# EAGLE design stm8s003_esc (EAGLE 9.0.1)
Assembly variants: A3940, A3941

## Sheet 1 of 3
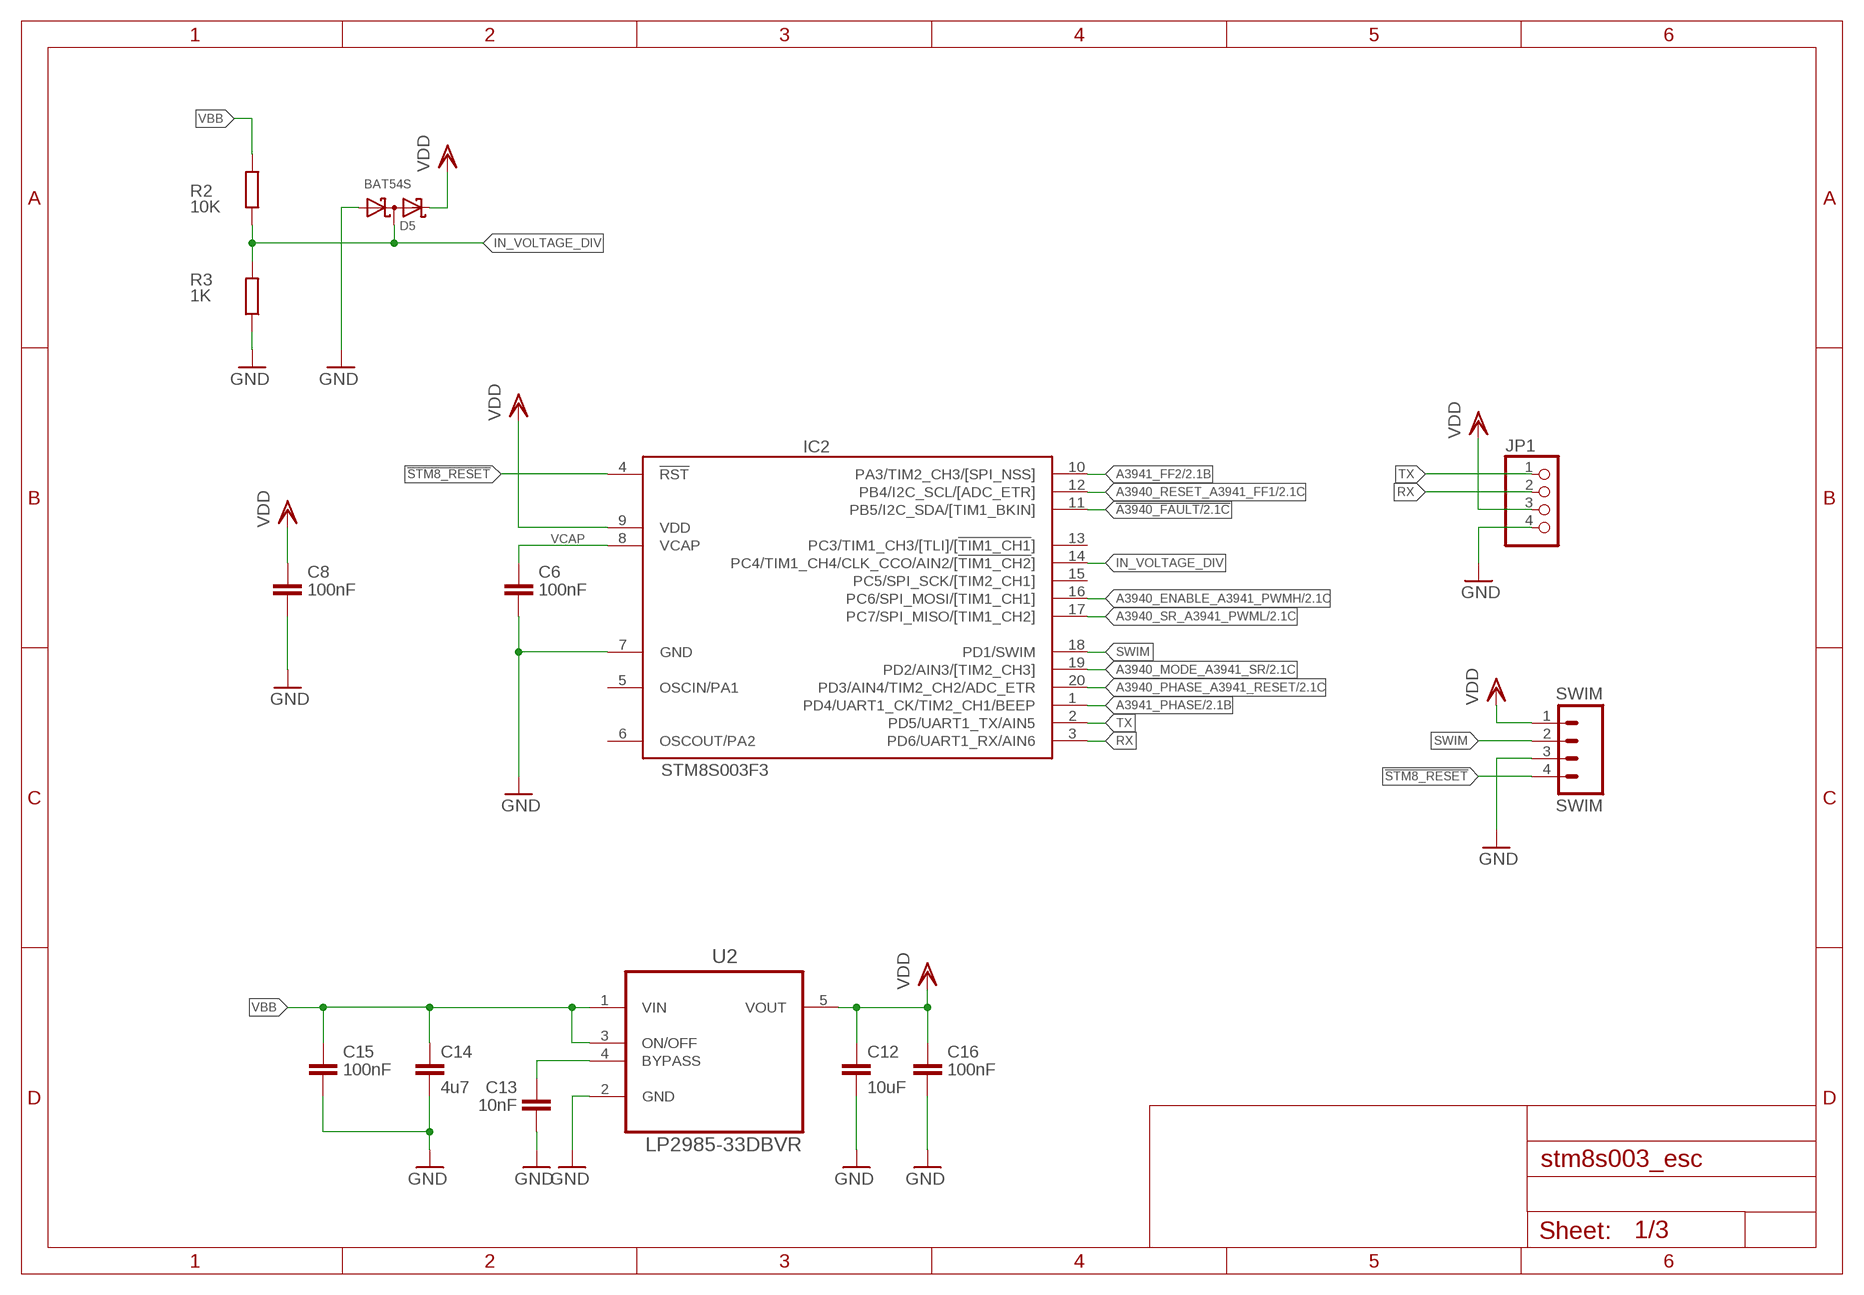
[diagram p0: schematic, sheet 1]

### Parts
C6  100nF  C-EUC0603  [C0603]
C8  100nF  C-EUC0603  [C0603]
C12  10uF  C-EUC0805  [C0805]
C13  10nF  C-EUC0603  [C0603]
C14  4u7  C-EUC0805  [C0805]
C15  100nF  C-EUC0603  [C0603]
C16  100nF  C-EUC0603K  [C0603K]
D5  BAT54S  [SOT23]
IC2  STM8S003F3  [TSSOP20]
JP1  PINHD-1X4  [1X04]
R2  10K  R-EU_R0603  [R0603]
R3  1K  R-EU_R0603  [R0603]
SWIM  SWIM  M041.27MM  [1X04-1.27MM]
U2  LP2985-33DBVR  LP2985AIM5-3.3  [SOT95P284X119-5N]

### Nets
!A3940_FAULT: IC2.11(PB5/I2C_SDA/[TIM1_BKIN]) ; also sheet 2
!STM8_RESET: IC2.4(!RST) SWIM.4
A3940_ENABLE_A3941_PWMH: IC2.16(PC6/SPI_MOSI/[TIM1_CH1]) ; also sheet 2
A3940_MODE_A3941_SR: IC2.19(PD2/AIN3/[TIM2_CH3]) ; also sheet 2
A3940_PHASE_A3941_RESET: IC2.20(PD3/AIN4/TIM2_CH2/ADC_ETR) ; also sheet 2
A3940_RESET_A3941_FF1: IC2.12(PB4/I2C_SCL/[ADC_ETR]) ; also sheet 2
A3940_SR_A3941_PWML: IC2.17(PC7/SPI_MISO/[TIM1_CH2]) ; also sheet 2
A3941_FF2: IC2.10(PA3/TIM2_CH3/[SPI_NSS]) ; also sheet 2
A3941_PHASE: IC2.1(PD4/UART1_CK/TIM2_CH1/BEEP) ; also sheet 2
GND: C6.2 C8.2 C12.2 C13.2 C14.2 C15.2 C16.2 D5.1(A1) IC2.7(GND) JP1.4 R3.1 SWIM.3 U2.2(GND) ; also sheet 2,3
IN_VOLTAGE_DIV: D5.3(C1A2) IC2.14(PC4/TIM1_CH4/CLK_CCO/AIN2/[!TIM1_CH2!]) R2.1 R3.2
LP2985_BYPASS: C13.1 U2.4(BYPASS)
RX: IC2.3(PD6/UART1_RX/AIN6) JP1.2
SWIM: IC2.18(PD1/SWIM) SWIM.2
TX: IC2.2(PD5/UART1_TX/AIN5) JP1.1
VBB: C14.1 C15.1 R2.2 U2.1(VIN) U2.3(ON/OFF) ; also sheet 2
VCAP: C6.1 IC2.8(VCAP)
VDD: C8.1 C12.1 C16.1 D5.2(C2) IC2.9(VDD) JP1.3 SWIM.1 U2.5(VOUT)
Unconnected: IC2.5(OSCIN/PA1) IC2.6(OSCOUT/PA2) IC2.13(PC3/TIM1_CH3/[TLI]/[!TIM1_CH1!]) IC2.15(PC5/SPI_SCK/[TIM2_CH1])

## Sheet 2 of 3
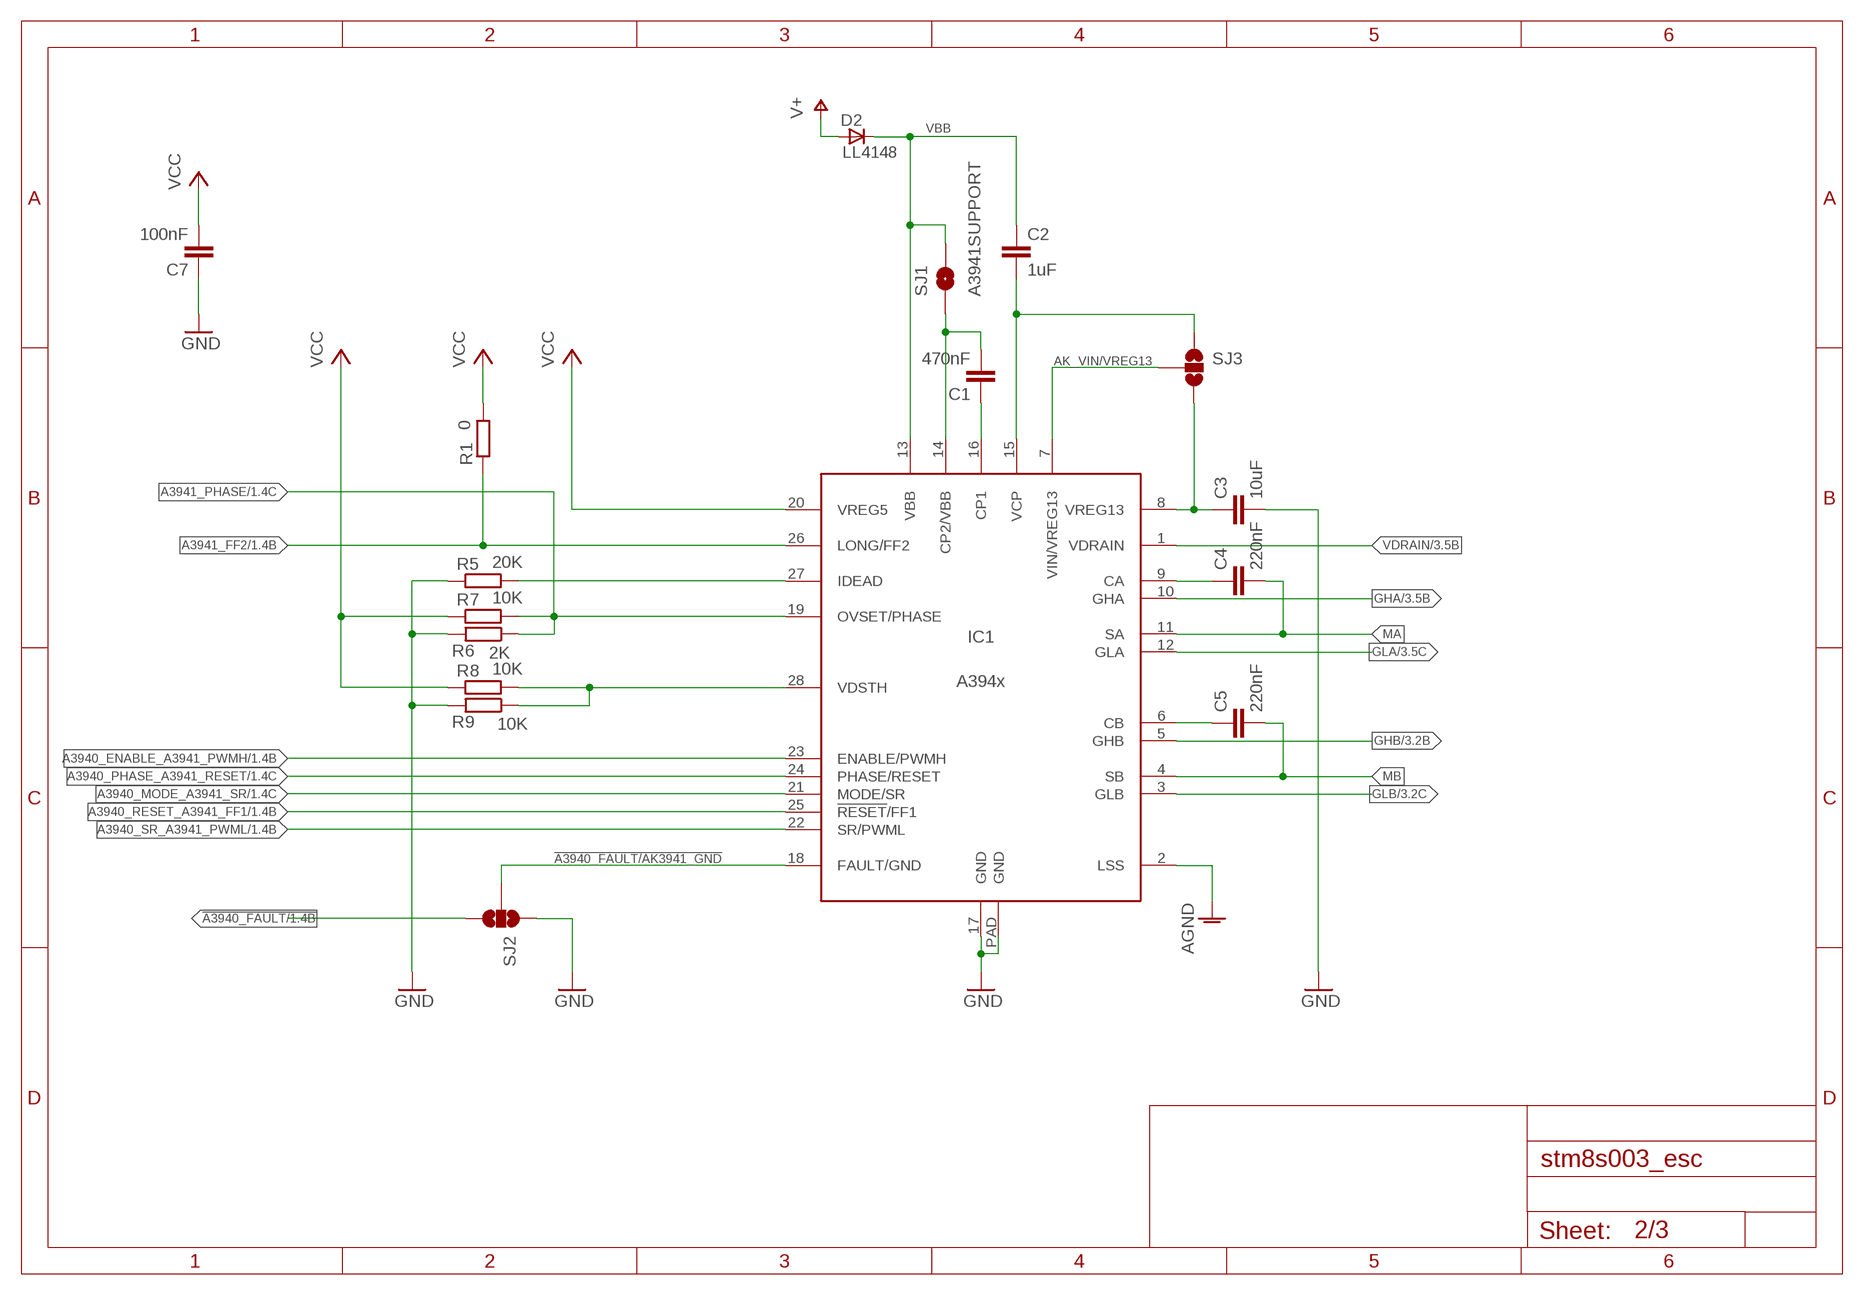
[diagram p1: schematic, sheet 2]

### Parts
C1  470nF  C-EUC0603  [C0603]
C2  1uF  C-EUC0603  [C0603]
C3  10uF  C-EUC0603  [C0603]
C4  220nF  C-EUC0603  [C0603]
C5  220nF  C-EUC0603  [C0603]
C7  100nF  C-EUC0603  [C0603]
D2  LL4148  [SOD80_DO213AA_MINIMELF]
IC1  A394x  A3940/41  [TSSOP28-PAD]
R1  0  R-EU_R0603  [R0603]
R5  20K  R-EU_R0603  [R0603]
R6  2K  R-EU_R0603  [R0603]
R7  10K  R-EU_R0603  [R0603]
R8  10K  R-EU_R0603  [R0603]
R9  10K  R-EU_R0603  [R0603]
SJ1  A3941SUPPORT  SOLDERJUMPERNO  [SJ_2S-NO]
SJ2  SOLDERJUMPER_2WAYPASTE2&3  [SJ_3_PASTE2&3]
SJ3  SOLDERJUMPER_2WAYPASTE2&3  [SJ_3_PASTE2&3]

### Nets
!A3940_FAULT: SJ2.3 ; also sheet 1
!A3940_FAULT/AK3941_GND: IC1.18(FAULT/GND) SJ2.2
A3940_ENABLE_A3941_PWMH: IC1.23(ENABLE/PWMH) ; also sheet 1
A3940_MODE_A3941_SR: IC1.21(MODE/SR) ; also sheet 1
A3940_PHASE_A3941_RESET: IC1.24(PHASE/RESET) ; also sheet 1
A3940_RESET_A3941_FF1: IC1.25(!RESET!/FF1) ; also sheet 1
A3940_SR_A3941_PWML: IC1.22(SR/PWML) ; also sheet 1
A3941_FF2: IC1.26(LONG/FF2) R1.1 ; also sheet 1
A3941_PHASE: IC1.19(OVSET/PHASE) R6.1 R7.2 ; also sheet 1
AGND: IC1.2(LSS) ; also sheet 3
AK_CA: C4.1 IC1.9(CA)
AK_CB: C5.1 IC1.6(CB)
AK_VDSTH: IC1.28(VDSTH) R8.2 R9.1
AK_VIN/VREG13: IC1.7(VIN/VREG13) SJ3.2
AK_VREG13: C3.1 IC1.8(VREG13) SJ3.3
CP1: C1.1 IC1.16(CP1)
CP2: C1.2 IC1.14(CP2/VBB) SJ1.1
GHA: IC1.10(GHA) ; also sheet 3
GHB: IC1.5(GHB) ; also sheet 3
GLA: IC1.12(GLA) ; also sheet 3
GLB: IC1.3(GLB) ; also sheet 3
GND: C3.2 C7.1 IC1.17(GND) IC1.PAD(GND) R5.1 R6.2 R9.2 SJ2.1 ; also sheet 1,3
IDEAD: IC1.27(IDEAD) R5.2
MA: C4.2 IC1.11(SA)
MB [AKPINS]: C5.2 IC1.4(SB)
V+: D2.A ; also sheet 3
VBB: C2.1 D2.C IC1.13(VBB) SJ1.2 ; also sheet 1
VCC: C7.2 IC1.20(VREG5) R1.2 R7.1 R8.1
VCP: C2.2 IC1.15(VCP) SJ3.1
VDRAIN: IC1.1(VDRAIN) ; also sheet 3

## Sheet 3 of 3
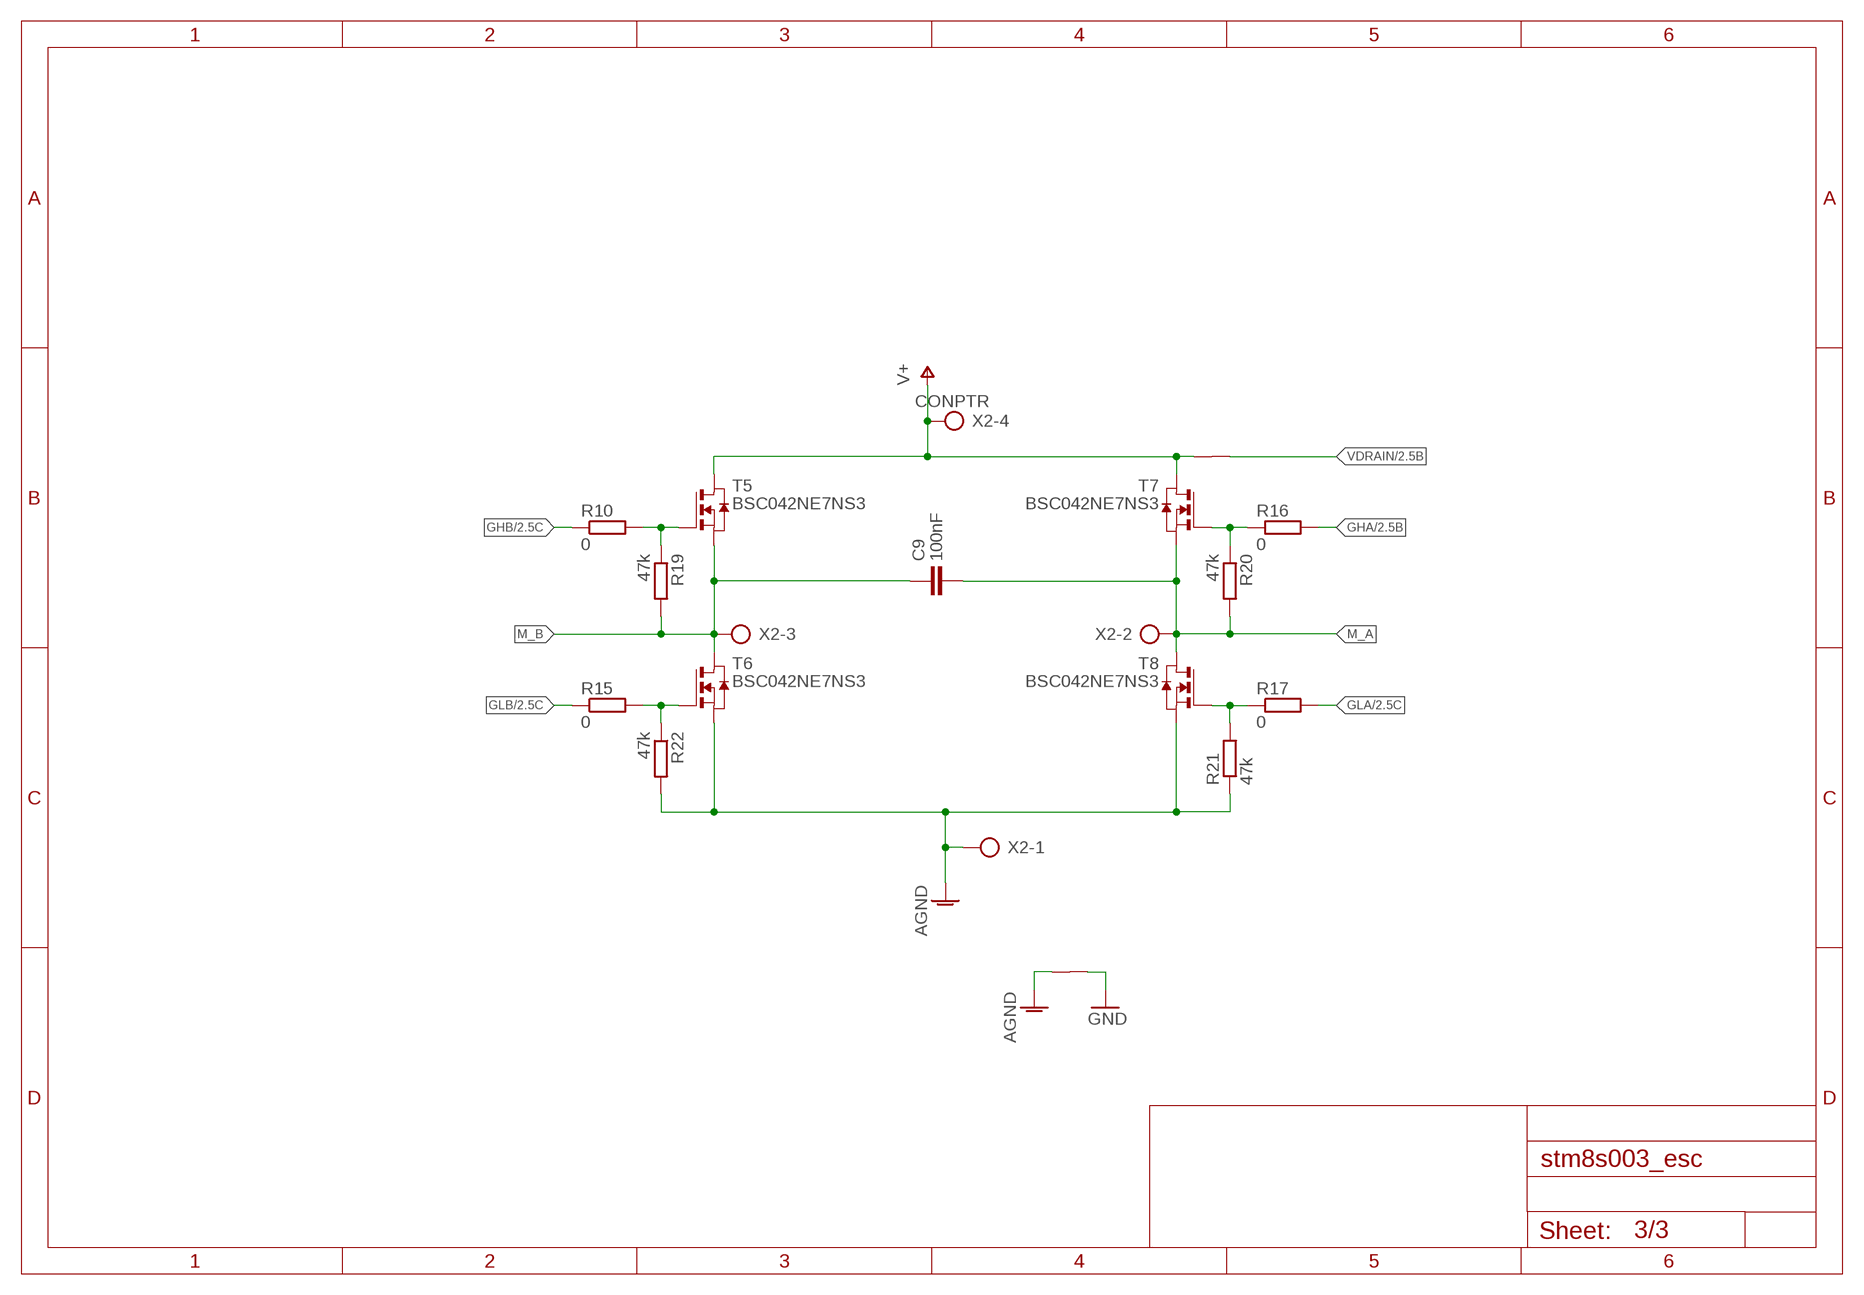
[diagram p2: schematic, sheet 3]

### Parts
C9  100nF  C-EUC0603  [C0603]
GND_JUNCTION  AGND_DGND_JUNCTION  [AGND_DGND_JUNCTION]
R10  0  R-EU_R0603  [R0603]
R15  0  R-EU_R0603  [R0603]
R16  0  R-EU_R0603  [R0603]
R17  0  R-EU_R0603  [R0603]
R19  47k  R-EU_R0603  [R0603]
R20  47k  R-EU_R0603  [R0603]
R21  47k  R-EU_R0603  [R0603]
R22  47k  R-EU_R0603  [R0603]
T5  BSC042NE7NS3  BSC067N06LS3_G_PG-TDSON-8  [PG-TDSON-8]
T6  BSC042NE7NS3  BSC067N06LS3_G_PG-TDSON-8  [PG-TDSON-8]
T7  BSC042NE7NS3  BSC067N06LS3_G_PG-TDSON-8  [PG-TDSON-8]
T8  BSC042NE7NS3  BSC067N06LS3_G_PG-TDSON-8  [PG-TDSON-8]
V+_JUNCTION  AGND_DGND_JUNCTION  [AGND_DGND_JUNCTION]
X2  CONPTR  AK300/4  [AK300/4]

### Nets
AGND: GND_JUNCTION.AGND R21.1 R22.2 T6.1(S) T6.2(S) T6.3(S) T8.1(S) T8.2(S) T8.3(S) X2.1 ; also sheet 2
GHA: R16.2 ; also sheet 2
GHA_R: R16.1 R20.1 T7.4(G)
GHB: R10.1 ; also sheet 2
GHB_R: R10.2 R19.1 T5.4(G)
GLA: R17.2 ; also sheet 2
GLA_R: R17.1 R21.2 T8.4(G)
GLB: R15.1 ; also sheet 2
GLB_R: R15.2 R22.1 T6.4(G)
GND: GND_JUNCTION.DGND ; also sheet 1,2
M_A [AKPINS]: C9.2 R20.2 T7.1(S) T7.2(S) T7.3(S) T8.5(D) T8.6(D) T8.7(D) T8.8(D) T8.D X2.2
M_B [AKPINS]: C9.1 R19.2 T5.1(S) T5.2(S) T5.3(S) T6.5(D) T6.6(D) T6.7(D) T6.8(D) T6.D X2.3
V+: T5.5(D) T5.6(D) T5.7(D) T5.8(D) T5.D T7.5(D) T7.6(D) T7.7(D) T7.8(D) T7.D V+_JUNCTION.AGND X2.4 ; also sheet 2
VDRAIN: V+_JUNCTION.DGND ; also sheet 2

## Library data of the parts
C1-C5 C7 = resistor:C-EU: CAPACITOR, European symbol
C6 C8 C9 C15 C16 = rcl:C-EU: CAPACITOR, European symbol; OC_LOMEX: 82-06-23
C12 C14 = rcl:C-EU: CAPACITOR, European symbol
C13 = rcl:C-EU: CAPACITOR, European symbol; OC_LOMEX: 82-08-73
D2 = _hhn_diodes_smd:LL4148: 1N4148 General Purpose Rectifie SMD-Version of 1N4148 Case: SOD 80 = DO 213 AA = MINIMELF (Glass) Author: Dipl.-Ing. FH Rainer Bayer HHN Hochschule Heilbronn, rainer.bayer@hs-heilbronn.de Ingenieurbüro ing-rb, mail@ing-rb.de
D5 = diode:BAT54S: Schottky Diodes Pin connection corrected 2011-05-04 Source: Fairchild .. BAT54.pdf; OC_RET: 95-03-19
GND_JUNCTION V+_JUNCTION = martonmiklos:AGND_DGND_JUNCTION
IC1 = allegro:A3940/41: Combined symbol for A3940 and A3941. The pins with different pin functions has the following naming convention: <A3940 name>/<A3941 name>
IC2 = stm8:STM8S003: Value line, 16 MHz STM8S 8-bit MCU, 8 Kbytes Flash, 128 bytes data EEPROM, 10-bit ADC, 3 timers, UART, SPI, I2C
JP1 = pinhead:PINHD-1X4: PIN HEADER
R1-R3 R5-R10 R15-R17 R19-R22 = rcl:R-EU_: RESISTOR, European symbol
SJ1 = SparkFun:SOLDERJUMPER: Solder Jumper Standard SMD solder jumper. Used to automate production. Two varients : Normally Open and Normally Closed are the same, but have different paste layers. NC will have a large amount of paste and should jumper during reflow.
SJ2 SJ3 = SparkFun:SOLDERJUMPER_2WAY: Solder Jumper 2 way solder jumper
SWIM = SparkFun:M04: Header 4 Standard 4-pin 0.1" header. Use with straight break away headers (SKU : PRT-00116), right angle break away headers (PRT-00553), swiss pins (PRT-00743), machine pins (PRT-00117), and female headers (PRT-00115). Molex polarized connector foot print use with SKU : PRT-08231 with associated crimp pins and housings. 1MM SMD Version SKU: PRT-10208
T5-T8 = PG-TDSON-8:BSC067N06LS3_G_PG-TDSON-8
U2 = NSC_By_element14_Batch_1.1:LP2985AIM5-3.3: Low-Dropout Regulator; MPN: LP2985AIM5-3.3; OC_FARNELL: 9778276; OC_NEWARK: 97K3686; OC_TME: LP2985-33DBVR; PACKAGE: SOT23-5; SUPPLIER: National Semiconductor
X2 = con-ptr500:AK300/4: CONNECTOR; OC_FARNELL: unknown; OC_NEWARK: unknown

## Board
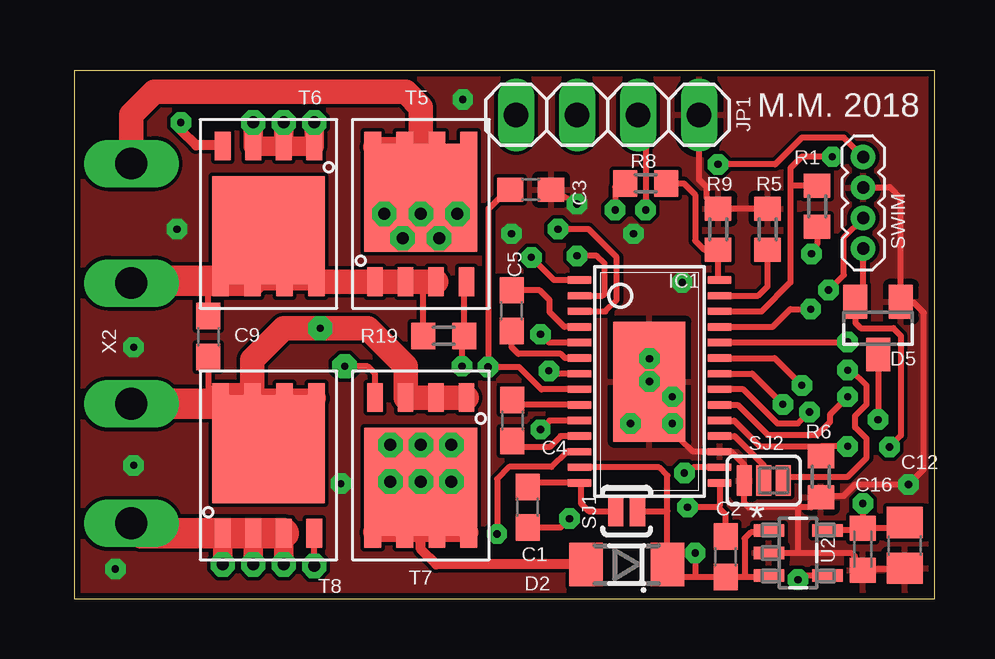
[diagram p3: board, top side]
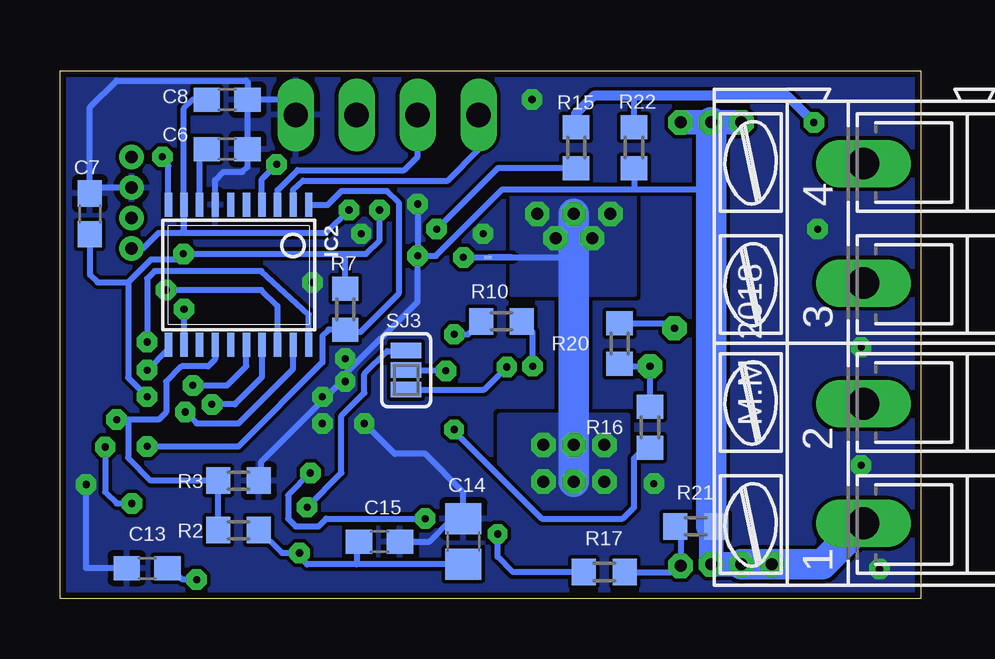
[diagram p4: board, bottom side, seen from below]

Size 35.86 x 22 mm. Coordinates in mm from the lower left corner, seen from the top.
Outline: 0,0 35.86,0 35.86,22 0,22 0,0
Copper layers (1*16): Top 0.035mm / dielectric 1.5mm / Bottom 0.035mm
Design rules "dirt_cheap_dirty_boards.v1": minimum track width 5mil, minimum drill 0.3mm, track to track 6mil, track to pad 6mil, pad to pad 6mil, via to via 6mil, smd to smd 0mil, copper to edge 10mil, drill to drill 10mil, minimum pad ring 10mil, minimum via ring 6mil, stop-mask expansion 2mil, vias tented up to drill 25mil, thermal gap 10mil

### Footprints (pad centres in the part's own frame; a part is rotated, then mirrored left to right if it is on the bottom)
C0603 = smd 1.1 x 1: 1 -0.85,0; 2 0.85,0
C0805 = smd 1.3 x 1.5: 1 -0.95,0; 2 0.95,0
C0603K = smd 1.05 x 1.08: 1 -0.875,0; 2 0.875,0
SOD80_DO213AA_MINIMELF = smd 1.4 x 1.8: A 1.7,0; C -1.7,0
SOT23 = smd 1 x 1.4: 1 -0.95,-1.1; 2 0.95,-1.1; 3 0,1.1
AGND_DGND_JUNCTION = smd 0.305 x 0.152: AGND 0,0; DGND 0,0
TSSOP28-PAD = smd 0.305 x 0.991: 1 -4.225,-2.918; 2 -3.575,-2.918; 3 -2.925,-2.918; 4 -2.275,-2.918; 5 -1.625,-2.918; 6 -0.975,-2.918; 7 -0.325,-2.918; 8 0.325,-2.918; 9 0.975,-2.918; 10 1.625,-2.918; 11 2.275,-2.918; 12 2.925,-2.918; 13 3.575,-2.918; 14 4.225,-2.918; 15 4.225,2.918; 16 3.575,2.918; 17 2.925,2.918; 18 2.275,2.918; 19 1.625,2.918; 20 0.975,2.918; 21 0.325,2.918; 22 -0.325,2.918; 23 -0.975,2.918; 24 -1.625,2.918; 25 -2.275,2.918; 26 -2.925,2.918; 27 -3.575,2.918; 28 -4.225,2.918 | smd 5 x 3: PAD 0,0
TSSOP20 = smd 0.305 x 0.991: 1 -2.925,-2.918; 2 -2.275,-2.918; 3 -1.625,-2.918; 4 -0.975,-2.918; 5 -0.325,-2.918; 6 0.325,-2.918; 7 0.975,-2.918; 8 1.625,-2.918; 9 2.275,-2.918; 10 2.925,-2.918; 11 2.925,2.918; 12 2.275,2.918; 13 1.625,2.918; 14 0.975,2.918; 15 0.325,2.918; 16 -0.325,2.918; 17 -0.975,2.918; 18 -1.625,2.918; 19 -2.275,2.918; 20 -2.925,2.918
1X04 = drill 1.016 long: 1 -3.81,0; 2 -1.27,0; 3 1.27,0; 4 3.81,0
R0603 = smd 1 x 1.1: 1 -0.85,0; 2 0.85,0
SJ_2S-NO = smd 0.635 x 1.27: 1 -0.45,0; 2 0.45,0
SJ_3_PASTE2&3 = smd 0.635 x 1.27: 1 -0.813,0; 2 0,0; 3 0.813,0
1X04-1.27MM = drill 0.508 pad 1: 1 0,0; 2 1.27,0; 3 2.54,0; 4 3.81,0
PG-TDSON-8 = smd 0.65 x 1.2: 1 -1.905,-2.825; 2 -0.635,-2.825; 3 0.635,-2.825; 4 1.905,-2.825 | smd 0.7 x 1.27: 5 2,2.79; 6 0.67,2.79; 7 -0.67,2.79; 8 -2,2.79 | smd 4.7 x 4.5: D 0,0.675
SOT95P284X119-5N = smd 1.27 x 0.533: 1 -1.219,0.94; 2 -1.219,0; 3 -1.219,-0.94; 4 1.219,-0.94; 5 1.219,0.94
AK300/4 = drill 1.321 long: 1 -7.493,0; 2 -2.515,0; 3 2.515,0; 4 7.493,0

### Placement (x,y rotation side)
C1  18.89,3.81 90 top
C2  27.15,1.75 90 top
C3  19.02,17.05 0 top
C4  18.26,7.42 270 top
C5  18.22,12 90 top
C6  28.89,18.73 0 bottom
C7  34.61,16.03 270 bottom
C8  28.89,20.8 0 bottom
C9  5.59,10.92 270 top
C12  34.61,2.22 270 top
C13  32.23,1.27 180 bottom
C14  19.05,2.38 90 bottom
C15  22.54,2.38 0 bottom
C16  32.86,2.06 270 top
D2  23.02,1.43 180 top
D5  33.5,11.27 180 top
GND_JUNCTION  20.95,14.29 0 bottom
IC1  23.97,9.05 270 top
IC2  28.42,13.49 180 bottom
JP1  22.23,20.16 0 top
R1  30.96,16.35 270 top
R2  28.42,2.86 0 bottom
R3  28.42,4.92 180 bottom
R5  28.89,15.4 270 top
R6  31.11,5.08 270 top
R7  23.97,12.06 270 bottom
R8  23.81,17.3 0 top
R9  26.83,15.4 90 top
R10  17.46,11.56 0 bottom
R15  14.35,18.8 90 bottom
R16  11.27,7.14 270 bottom
R17  13.18,1.11 180 bottom
R19  15.4,10.95 180 top
R20  12.54,10.64 90 bottom
R21  9.37,3.02 180 bottom
R22  11.94,18.8 270 bottom
SJ1  23.02,3.65 0 top
SJ2  28.73,4.92 0 top
SJ3  21.43,9.53 270 bottom
SWIM  32.88,14.59 90 top
T5  14.45,16.03 0 top
T6  8.1,16.03 180 top
T7  14.45,5.56 180 top
T8  8.1,5.56 0 top
U2  30.16,1.91 0 top
V+_JUNCTION  18.02,14.22 180 bottom
X2  2.38,10.64 90 bottom

### Tracks (layer width: path | path; a pad name or v marks a point on that pad's centre or on a via)
!A3940_FAULT  (via drill 0.3 pad 0.85)
  Top 0.254: SJ2.3 29.55,5.08 32.23,5.08 33.02,5.87 33.02,6.67 32.54,7.14 32.54,7.62 33.02,8.1 33.02,8.89 32.38,9.53 v32.23,9.53
  Bottom 0.254: v32.23,9.53 31.34,10.41 IC2.11
!A3940_FAULT/AK3941_GND
  Top 0.254: IC1.18 27.52,6.77 28.73,5.56 SJ2.2
!STM8_RESET  (via drill 0.3 pad 0.85)
  Top 0.254: SWIM.4 32.07,19.21 30.32,19.21 29.21,18.1 v26.83,18.1
  Bottom 0.254: IC2.4 27.44,17.48 v26.83,18.1
A3940_ENABLE_A3941_PWMH  (via drill 0.3 pad 0.85)
  Top 0.254: IC1.23 29.19,10.02 v30.32,8.89
  Bottom 0.254: v30.32,8.89 28.89,8.89 28.09,9.69 IC2.16
A3940_MODE_A3941_SR  (via drill 0.3 pad 0.85)
  Top 0.254: IC1.21 27.88,8.72 29.3,7.3 30.16,7.3 v30.64,7.78
  Bottom 0.254: v30.64,7.78 30.16,7.3 28.42,7.3 26.14,9.58 IC2.19
A3940_PHASE_A3941_RESET  (via drill 0.3 pad 0.85)
  Top 0.254: v32.23,10.7 31.95,10.67 IC1.24
  Bottom 0.254: IC2.20 25.49,11.84 27.46,13.65 31.91,13.65 32.23,13.34 v32.23,10.7
A3940_RESET_A3941_FF1  (via drill 0.3 pad 0.85)
  Top 0.254: IC1.25 29.1,11.32 29.84,12.06 v30.69,12.06
  Bottom 0.254: v30.69,12.06 30.69,11.48 IC2.12
A3940_SR_A3941_PWML  (via drill 0.3 pad 0.85)
  Top 0.254: IC1.22 28.25,9.37 v29.53,8.1
  Bottom 0.254: IC2.17 27.44,9.23 28.57,8.1 v29.53,8.1
A3941_FF2  (via drill 0.3 pad 0.85)
  Top 0.254: IC1.26 28.64,11.97 29.84,13.18 29.84,17.14 | v31.59,18.41 30.32,18.41 29.84,17.94 29.84,17.14 | R1.1 29.9,17.2 29.84,17.14
  Bottom 0.254: IC2.10 31.34,18.03 v31.59,18.41
A3941_PHASE  (via drill 0.3 pad 0.85)
  Top 0.254: IC1.19 27.5,7.42 28.57,6.35 31.06,6.35 31.03,5.83 31.05,5.82 31.05,5.71 R6.1 31.11,6.35 | v32.23,6.35 31.11,6.35 | 31.11,6.35 31.06,6.13
  Bottom 0.254: v32.23,6.35 28.42,6.35 24.92,9.84 24.92,10.95 24.66,11.21 R7.2 23.97,11.11 23.34,11.11 21.91,12.54 21.91,12.55 21.75,12.71 21.75,16.51 22.23,16.99 24.13,16.99 24.7,16.41 IC2.1
AGND  (via drill 0.3 pad 0.85, 0.5 pad 1.02)
  Top 0.254: IC1.2 22.02,12.62 22.1,12.7 22.1,13.97 21.78,14.29 GND_JUNCTION.AGND
  Top 0.813: T6.2 T6.3 v7.46,19.84 | T6.2 T6.1 v10,19.84 | T6.2 v8.73,19.84 | T8.3 v8.73,1.43 | v7.46,1.43 T8.2 | T8.1 v6.19,1.43
  Top 1.27: T8.3 T8.2 T8.1 2.79,2.73 X2.1
  Bottom 0.254: R21.1 8.73,3.02 | 8.73,16.99 8.8,17.05 11.94,17.05 | 8.57,17.78 8.73,17.62 | GND_JUNCTION.AGND 20.19,14.29 17.43,17.05 11.94,17.05 | R22.2 11.94,17.05
  Bottom 1.016: v7.46,19.84 v8.73,19.84 v10,19.84 | v7.46,1.43 v8.73,1.43 8.73,3.02
  Bottom 1.27: v7.46,1.43 v6.19,1.43 4.1,1.43 X2.1 | 8.73,3.02 8.73,16.99 8.73,17.62 v8.73,19.84
  other vias: 20.95,14.29
AK_CA
  Top 0.254: IC1.9 18,8.07 C4.1
AK_CB
  Top 0.254: IC1.6 20.46,10.02 20.28,10.2 18.5,10.2 18.22,10.48 C5.1
AK_VDSTH
  Top 0.254: IC1.28 26.83,13.33 26.83,14.45 | 26.83,14.45 R9.1 26.25,14.55 25.88,14.92 25.88,16.83 25.4,17.3 R8.2 | 26.83,14.45 26.93,14.55 26.88,14.61
AK_VIN/VREG13  (via drill 0.3 pad 0.85)
  Top 0.254: v19.78,9.49 20.15,9.37 IC1.7
  Bottom 0.254: SJ3.2 19.97,9.53 19.75,9.49 v19.78,9.49
AK_VREG13  (via drill 0.3 pad 0.85)
  Top 0.254: C3.1 18.17,17.15 17.27,16.26 17.27,9.65 | IC1.8 19.47,8.72 18.54,9.65 17.27,9.65 | v17.24,9.65 17.27,9.65
  Bottom 0.254: SJ3.3 18.18,8.71 v17.24,9.65
CP1  (via drill 0.3 pad 0.85)
  Top 0.254: IC1.16 25.79,5.47 25.4,5.08 | 25.4,5.08 25.4,5.24 | 25.4,5.08 25.42,5.06 v25.42,5.24 | v20.64,3.33 20.26,2.96 C1.1
  Bottom 0.254: 20.59,3.33 v20.64,3.33 24.77,3.33 25.08,3.02 26.04,3.02 26.35,3.33 26.35,4.31 v25.42,5.24
CP2
  Top 0.254: SJ1.1 21.43,3.65 21.11,3.97 21.11,4.76 IC1.14 19.05,4.82 C1.2
GHA  (via drill 0.3 pad 0.81)
  Top 0.254: IC1.10 19.81,7.42 v19.43,7.05
  Bottom 0.254: v19.43,7.05 19.43,6.99 15.78,3.33 12.41,3.33 11.94,3.81 11.94,5.84 11.49,6.29 R16.2
GHA_R  (via drill 0.3 pad 1.02)
  Top 0.254: v11.27,9.68 12.22,9.68 12.54,9.37 T7.4
  Bottom 0.254: R20.1 12.44,9.68 v11.27,9.68 R16.1
GHB  (via drill 0.3 pad 0.85)
  Top 0.254: IC1.5 19.77,10.67 v19.43,11.02
  Bottom 0.254: v19.43,11.02 18.85,11.02 R10.1
GHB_R  (via drill 0.3 pad 0.85)
  Top 0.152: 16.16,10.87 R19.1
  Top 0.254: R19.1 16.25,13.11 T5.4 | v16.16,9.68 16.16,10.87
  Bottom 0.254: v16.16,9.68 16.16,11.11 R10.2
GLA  (via drill 0.3 pad 0.81)
  Top 0.254: v17.62,2.7 17.62,4.99 18.13,5.49 19.89,5.49 20.52,6.12 IC1.12
  Bottom 0.254: R17.2 16.99,1.11 17.62,1.75 v17.62,2.7
GLA_R  (via drill 0.5 pad 1.02)
  Top 0.254: v10,1.36 T8.4
  Bottom 0.254: R17.1 10,1.11 v10,1.36 10,2.8 R21.2
GLB  (via drill 0.3 pad 0.85)
  Top 0.254: IC1.3 22.13,11.97 22.61,12.45 22.61,14.22 21.43,15.4 v20.16,15.4
  Bottom 0.254: R15.1 17.61,17.95 v20.16,15.4
GLB_R  (via drill 0.3 pad 0.85)
  Top 0.406: T6.4 6.16,18.89 5.08,18.89 4.45,19.53 v4.45,19.84
  Bottom 0.254: R22.1 11.94,20.95
  Bottom 0.406: v4.45,19.84 5.56,20.95 11.94,20.95 13.62,20.95 14.35,20.23 R15.2
GND  (via drill 0.3 pad 0.85)
  Top 0.254: C16.2 32.82,1.23 | 32.82,1.23 32.54,1.51 32.54,1.75 32.38,1.91 U2.2 30.16,1.91 30.16,3.81 | C12.2 34.56,1.23 32.82,1.23 | R5.1 R9.2 26.35,16.73 26.35,17.14 26.04,17.46 JP1.4 | 30.16,3.81 30.7,3.81 30.7,4.23 R6.2 31.17,4.29 32.07,4.29 32.54,4.76 v34.77,4.76 35.4,5.4 35.4,11.91 34.94,12.37 D5.1 34.45,16.67 33.97,17.14 33.96,17.13 SWIM.3 | 30.16,3.81 28.1,3.81 27.92,3.99 SJ2.1 27.92,5.58 27.37,6.12 IC1.17 25.79,6.12 25.24,6.67 IC1.PAD 23.97,8.1 v23.18,7.3 | v20.95,16.45 20.35,16.8 C3.2
  Bottom 0.254: 29.39,17.04 IC2.7 29.39,17.44 29.05,17.78 28.26,17.78 28.04,18 C6.2 | v20.95,16.45 GND_JUNCTION.DGND 20.95,12.38 23.97,9.37 IC1.PAD 24.13,9.05 27.46,5.71 27.46,5.02 R3.1 | SWIM.3 33.33,17.13 33.34,17.14 34.35,17.14 | C14.2 19.21,3.49 | C14.2 19.05,4.45 20.64,6.03 21.91,6.03 v23.18,7.3 | C15.2 20.48,2.38 19.53,3.33 C14.2 | C13.2 34.77,1.27 v34.77,4.76 | C7.1 34.35,17.14 | 34.35,17.14 34.61,17.14 34.61,20.48 33.5,21.59 28.1,21.59 28.04,21.53 C8.2 | C6.2 C8.2 | C6.2 27.78,18.73 | JP1.4 26.67,20.8 C8.2
  other vias: 23.97,9.05 16.19,20.8 4.29,15.4 2.48,10.48 24.92,7.3 24.92,8.41 23.97,10 2.48,5.56 11.11,4.79 1.71,1.24 25.34,13.18 23.3,15.21 18.22,15.21
  pour Bottom (rank 2): 0,22.07 35.88,22.07 35.88,0 0,0
  pour Top: 0,22.07 35.88,22.07 35.88,0 0,0
IDEAD
  Top 0.254: IC1.27 28.5,12.62 28.89,13.02 R5.2
IN_VOLTAGE_DIV  (via drill 0.3 pad 0.85)
  Top 0.254: D5.3 v33.5,7.46
  Bottom 0.254: IC2.14 29.39,9.98 29.69,9.68 30.8,9.68 31.43,9.05 31.43,7.78 31.75,7.46 33.02,7.46 | R2.1 R3.2 32.07,4.92 33.02,5.87 33.02,7.46 | v33.5,7.46 33.02,7.46
LP2985_BYPASS  (via drill 0.3 pad 0.85)
  Top 0.254: U2.4 30.33,0.96 v30.16,0.79
  Bottom 0.254: v30.16,0.79 30.74,0.79 C13.1
M_A  (via drill 0.3 pad 1.02)
  Top 0.152: T8.8 5.99,8.24 | 5.99,8.24 5.87,8.12 | 5.59,8.64 5.99,8.24
  Top 0.254: C9.2 5.59,8.64
  Top 0.813: T8.7 8.1,8.35 | 8.1,8.35 T8.6 T8.5 | T8.D 8.1,8.35
  Top 1.016: T7.1 T7.2 T7.3 13.81,9.68 12.22,11.27 v10.26,11.27 8.73,11.27 7.43,9.97 T8.7
  Top 1.27: 5.87,8.12 X2.2 | T8.8 T8.7
  Bottom 0.254: R20.2 10.22,11.49 v10.26,11.27
M_B
  Top 0.152: T6.5 5.59,13.24 5.59,12.7
  Top 0.254: R19.2 14.55,13.11 14.45,13.21 | C9.1 5.59,12.7
  Top 0.813: 10.13,13.21 T6.8 T6.7 8.1,13.24 | 8.1,13.24 T6.6 T6.5 | T6.D 8.1,13.24
  Top 1.016: T5.3 14.45,13.21 T5.2 T5.1 10.13,13.21
  Top 1.27: X2.3 3.11,13.24 5.59,13.24 T6.6
MA
  Top 0.254: IC1.11 20.27,6.77 19.81,6.31 19.13,6.31 18.1,6.32 C4.2
MB
  Top 0.254: IC1.4 20.43,11.32 19.81,11.94 19.81,12.45 19.41,12.85 C5.2
RX
  Bottom 0.254: IC2.3 26.79,17.02 25.95,17.86 21.51,17.86 20.95,18.41 JP1.2
SWIM  (via drill 0.3 pad 0.85)
  Top 0.254: SWIM.2 32.07,15.05 32.07,13.49 v31.43,12.86
  Bottom 0.254: IC2.18 26.79,12.19 27.46,12.86 v31.43,12.86
TX
  Bottom 0.254: IC2.2 26.14,17.04 25.73,17.42 19.7,17.42 18.41,18.73 JP1.1
V+  (via drill 0.5 pad 1.02)
  Top 0.254: 15.2,3.25 15.12,3.33 | T5.D 15.12,17.38 T5.6 | T5.D 15.68,17.95 15.68,18.45 | T5.D 16.45,18.71 T5.5
  Top 0.406: D2.A 15.08,1.43 14.45,2.06 T7.D
  Top 0.813: v14.45,16.03 T5.D 14.45,18.89 13.84,18.89 T5.7 T5.8 | T7.8 T7.7 | T7.7 T7.6 T7.5 | T7.7 15.12,3.33 15.12,4.21 T7.D | 15.68,18.45 13.68,16.45
  Top 1.016: X2.4 2.38,20.16 3.33,21.11 13.81,21.11 14.45,20.48 14.45,18.89
  Bottom 0.254: V+_JUNCTION.AGND 14.97,14.22 14.45,14.48
  Bottom 1.27: T7.D 14.45,14.48 v14.45,16.03
  other vias: 14.45,4.88 12.92,16.03 15.97,16.03 15.21,15.02 13.68,15.02 15.72,4.88 15.72,6.41 14.45,6.41 13.18,6.41 13.18,4.88
  pour Bottom: 11.94,16.76 17.02,16.76 17.02,13.97 17.02,12.7 12.19,12.7 11.94,12.7
  pour Bottom: 12.19,7.62 17.53,7.62 17.53,5.08 16,3.81 12.45,3.81 12.19,4.06
VBB  (via drill 0.3 pad 0.85)
  Top 0.254: 24.72,3.65 D2.C 25.25,0.9 25.88,0.9 | 24.72,3.65 24.72,5.13 24.37,5.47 IC1.13 | SJ1.2 24.72,3.65 | 25.88,0.9 C2.1 27.94,0.9 | U2.3 28.87,0.9 27.94,0.9 | U2.1 28.55,2.77 28.19,2.77 27.94,2.52 27.94,0.9 | v25.88,1.91 25.88,0.9
  Bottom 0.254: C14.1 23.5,1.43 | 23.5,1.43 25.56,1.43 26.04,1.91 | 26.04,1.91 v25.88,1.91 | C15.1 23.5,2.3 23.5,1.43 | R2.2 26.61,1.91 26.04,1.91
VCAP
  Bottom 0.254: IC2.8 30.04,18.69 C6.1
VCC  (via drill 0.3 pad 0.85)
  Top 0.254: R8.1 22.86,17.46 22.54,17.14 v22.54,16.19 | IC1.20 27.64,8.07 28.89,6.83 30.96,6.83 31.5,7.37 31.5,7.62 31.5,7.68 v32.23,8.41 | R1.2 30.96,14.76 30.64,14.45 v30.72,14.37
  Bottom 0.254: v32.23,8.41 33.02,9.21 33.02,13.18 | 33.02,13.18 32.07,14.13 30.96,14.13 v30.72,14.37 23.97,14.37 | C7.2 34.61,13.49 34.29,13.18 33.02,13.18 | R7.1 23.97,14.37 | 23.97,14.37 23.1,14.37 22.54,14.92 v22.54,16.19
VCP  (via drill 0.3 pad 0.85)
  Top 0.254: 26.83,3.81 v25.56,3.81 | IC1.15 26.89,3.87 26.83,3.81 | C2.2 27.15,3.49 26.83,3.81
  Bottom 0.152: SJ3.1 21.45,10.32
  Bottom 0.254: 21.45,10.32 22.23,10.32 23.18,9.37 23.18,8.57 24.13,7.62 24.13,5.24 v25.56,3.81
VDD  (via drill 0.3 pad 0.85)
  Top 0.254: U2.5 32.77,2.85 C16.1 33.02,2.94 | C12.1 34.37,2.94 33.02,2.94 | SWIM.1 32.88,12.7 arc-90 D5.2 32.55,11.49 32.77,11.27 34.13,11.27 34.45,10.95 34.45,6.79 v33.97,6.32 | v32.86,3.97 32.86,3.1 33.02,2.94 | JP1.3 23.81,19.84 v23.81,16.19
  Bottom 0.254: 30.69,16.3 IC2.9 | SWIM.1 32.4,14.59 31.75,15.24 30.8,15.24 30.72,15.32 30.72,16.39 IC2.9 | v33.97,6.32 33.97,4.45 33.5,3.97 v32.86,3.97 | IC2.9 30.69,15.24 24.77,15.24 v23.81,16.19 | IC2.9 30.69,20.43 30.32,20.8 C8.1
VDRAIN  (via drill 0.3 pad 0.85)
  Top 0.254: v19.05,14.22 20,13.27 IC1.1
  Bottom 0.254: v19.05,14.22 17.02,14.22 17.77,14.22 V+_JUNCTION.DGND

### Text on the board
tNames: M.M. 2018
bNames: M.M. 2018